# Altium schematic sheet Schematic.SchDoc
size A4
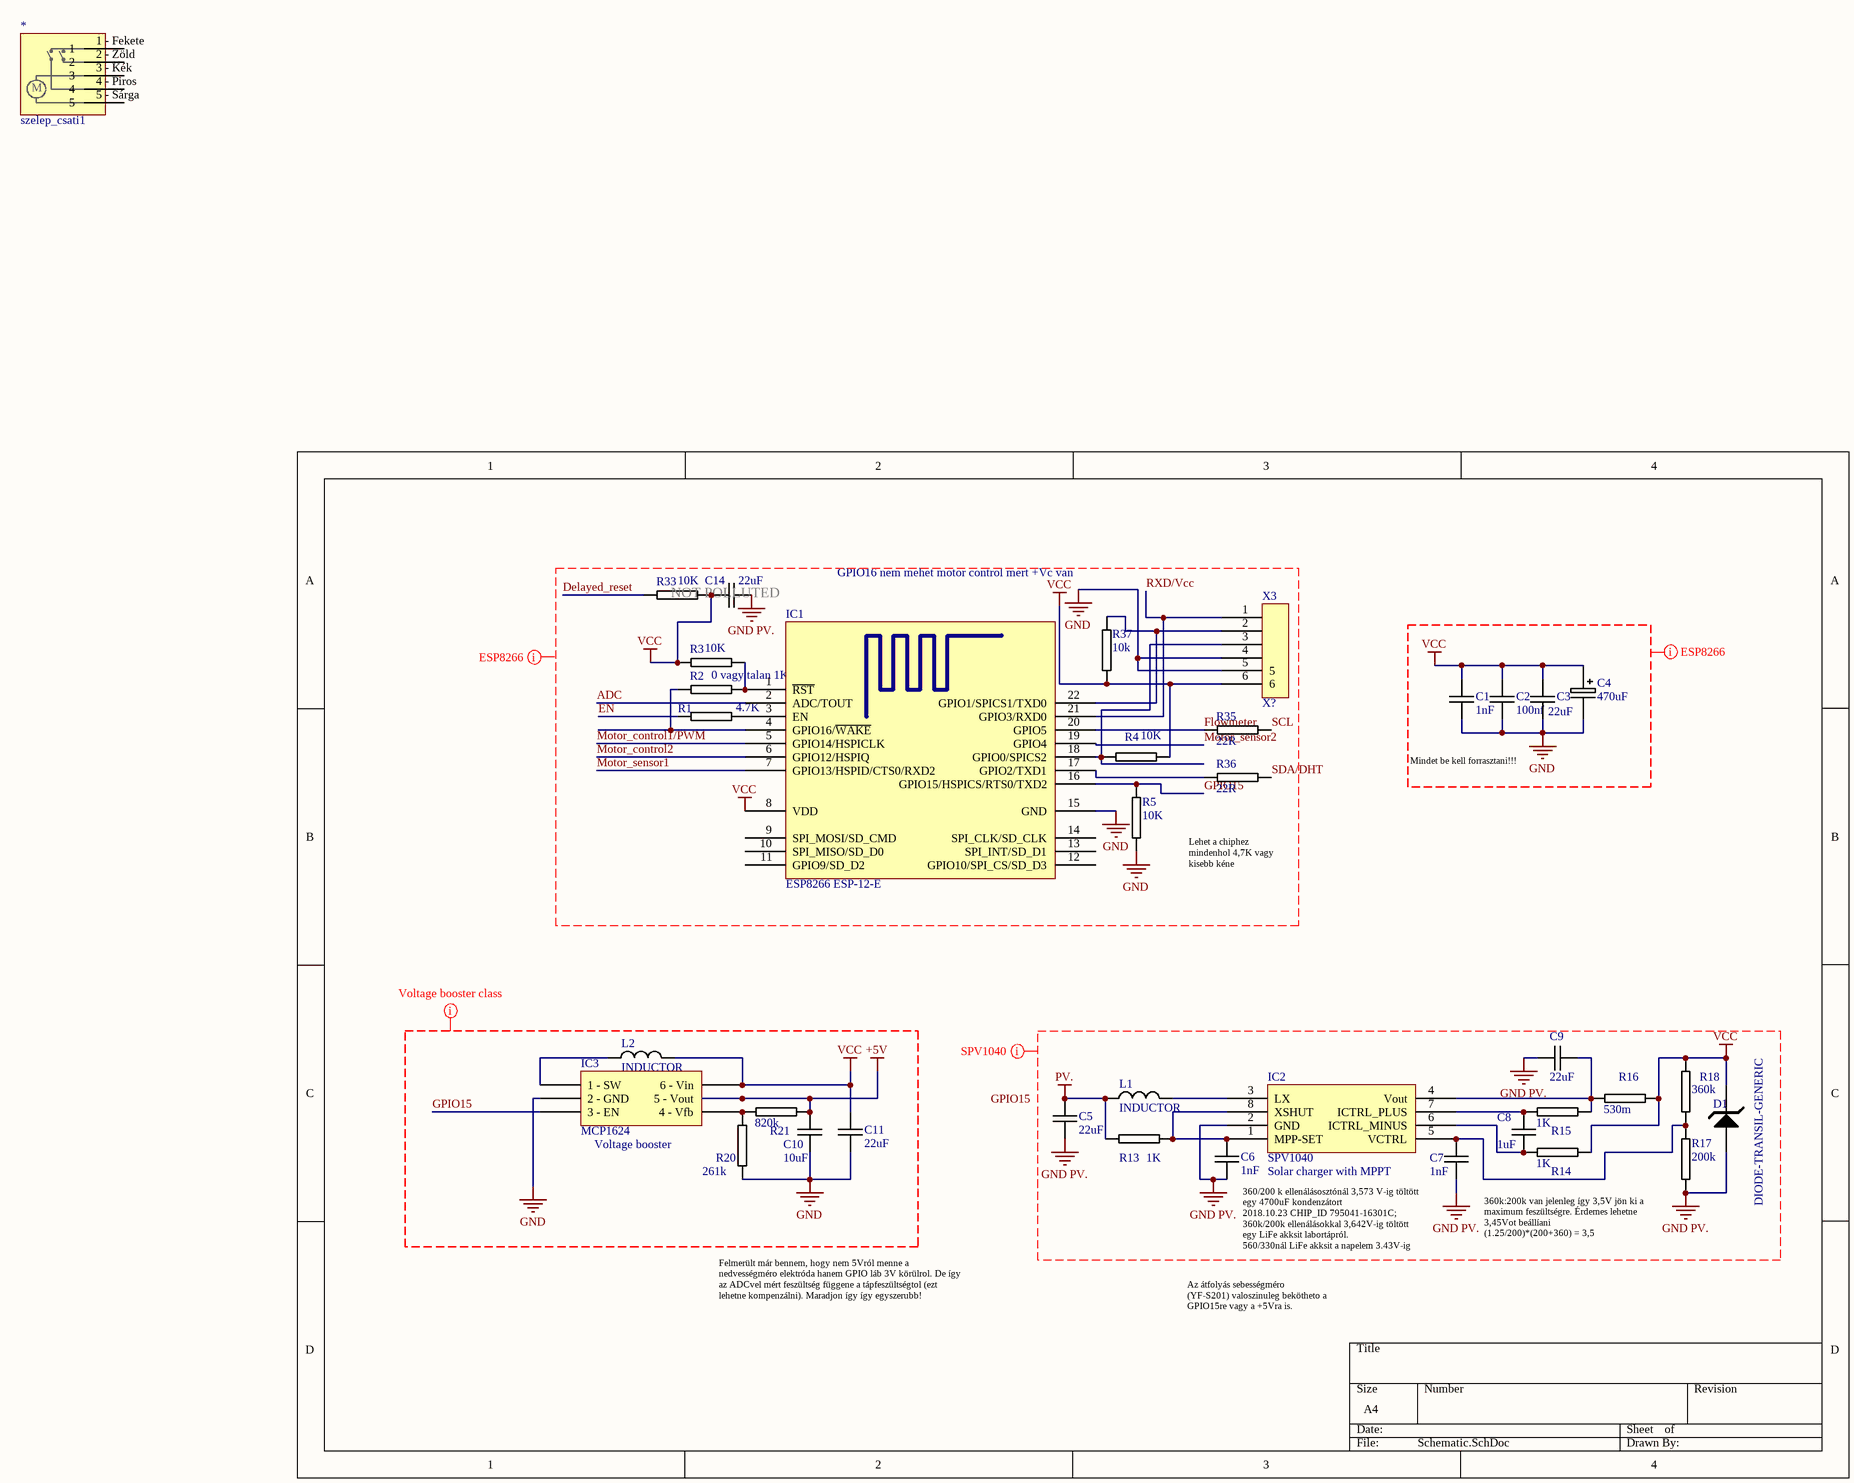
[diagram p0: Schematic.SchDoc]

## Parts
*  szelep_csati1  [Szelep_csati]
C1  1nF  [0805C-TBD]
C2  100nf  [1206C-GENERIC]
C3  22uF  [1206C-GENERIC]
C4  470uF  [PANACAP-D-GENERIC]
C5  22uF  [1206C-GENERIC]
C6  1nF  [0805C-TBD]
C7  1nF  [1206C-GENERIC]
C8  1uF  [0805C-TBD]
C9  22uF  [1206C-GENERIC]
C10  10uF  [1206C-GENERIC]
C11  22uF  [1206C-GENERIC]
C14  22uF  [0805C-GENERIC]
D1  DIODE-TRANSIL-GENERIC  [SOD523]
IC1  ESP8266 ESP-12-E  [ESP8266 ESP-12-E]
IC2  SPV1040  [SPV1040]
IC3  MCP1624  [SOT23-6]
L1  INDUCTOR  [Inductor 6x6mm]
L2  INDUCTOR  [INDM2520X190N]
R1  4.7K  [0805R-10K]
R2  0 vagy talan 1K?  [1206FB-50Z]
R3  10K  [0805R-10K]
R4  10K  [1206C-GENERIC]
R5  10K  [0805R-10K]
R13  1K  [1206FB-50Z]
R14  1K  [0805R-1K]
R15  1K  [0805R-1K]
R16  530m  [1206FB-50Z]
R17  200k  [0805R-680K]
R18  360k  [0805R-680K]
R20  261k  [0805R-820K]
R21  820k  [0805R-560K]
R33  10K  [0805R-10K]
R35  22R  [0805R-22]
R36  22R  [0805R-22]
R37  10k  [0805R-22]
X3  X?  [program port]

## Nets
+5V: C10.1 IC3.5(5_-_Vout) R21.2
GND: C1.2 C2.2 C3.2 C4.- C10.2 C11.2 IC1.15(GND) IC3.2(2_-_GND) R5.1 R20.2 X3.4 X3.5
GND PV.: C5.2 C6.2 C7.2 C9.1 C14.2 D1.A IC2.2(GND) R17.2
PV.: C5.1 L1.1 R13.2
VCC: C1.1 C2.1 C3.1 C4.+ C11.1 C14.1 D1.K IC1.8(VDD) IC3.6(6_-_Vin) L2.2 R3.1 R4.2 R14.1 R16.1 R18.1 R33.2 R37.2 X3.6
ADC: IC1.2(ADC/TOUT)
Delayed_reset: R33.1
EN: R1.1
Flowmeter: IC1.20(GPIO5) R35.2
GPIO15: IC1.16(GPIO15/HSPICS/RTS0/TXD2) IC3.3(3_-_EN) R5.2
Motor_control1/PWM: IC1.5(GPIO14/HSPICLK)
Motor_control2: IC1.6(GPIO12/HSPIQ)
Motor_sensor1: IC1.7(GPIO13/HSPID/CTS0/RXD2)
Motor_sensor2: IC1.19(GPIO4)
RXD/Vcc: IC1.21(GPIO3/RXD0) X3.1
SCL: R35.1
SDA/DHT: R36.1
NetC6_1: C6.1 IC2.1(MPP-SET) IC2.8(XSHUT) R13.1
NetC7_1: C7.1 IC2.5(VCTRL) R17.1 R18.2
NetC8_1: C8.1 IC2.7(ICTRL_PLUS) R15.2
NetC8_2: C8.2 IC2.6(ICTRL_MINUS) R14.2
NetC9_2: C9.2 IC2.4(Vout) R15.1 R16.2
NetIC1_1: IC1.1(~{RST}) R2.1 R3.2
NetIC1_3: IC1.3(EN) R1.2
NetIC1_4: IC1.4(GPIO16/~{WAKE}) R2.2
NetIC1_17: IC1.17(GPIO2/TXD1) R36.2
NetIC1_18: IC1.18(GPIO0/SPICS2) R4.1 X3.3
NetIC1_22: IC1.22(GPIO1/SPICS1/TXD0) R37.1 X3.2
NetIC2_3: IC2.3(LX) L1.2
NetIC3_1: IC3.1(1_-_SW) L2.1
NetIC3_4: IC3.4(4_-_Vfb) R20.1 R21.1

Not connected (* = marked no-connect by the designer): * 1 - Fekete(1) 2 - Zöld(2) 3 - Kék(3) 4 - Piros(4) 5 - Sárga(5); IC1 9(SPI_MOSI/SD_CMD) 10(SPI_MISO/SD_D0) 11(GPIO9/SD_D2) 12(GPIO10/SPI_CS/SD_D3) 13(SPI_INT/SD_D1) 14(SPI_CLK/SD_CLK)

## Layout directives
net class SPV1040: GND PV., PV., VCC
net class ESP8266: ADC, Delayed_reset, EN, Flowmeter, GND, GND PV., GPIO15, Motor_control1/PWM, Motor_control2, Motor_sensor1, Motor_sensor2, RXD/Vcc, SCL, SDA/DHT, VCC
net class Voltage Booster: +5V, GND, GPIO15, VCC

## Notes on the sheet
- NOT POLLUTED
- (near R37) GPIO16 nem mehet motor control mert +Vc van
- Mindet be kell forrasztani!!!
- Lehet a chiphez mindenhol 4,7K vagy kisebb kéne
- (near IC3) Voltage booster
- Solar charger with MPPT
- 360k:200k van jelenleg így 3,5V jön ki a maximum feszültségre. Érdemes lehetne 3,45Vot beállíani
  (1.25/200)*(200+360) = 3,5
- Felmerült már bennem, hogy nem 5Vról menne a nedvességméro elektróda hanem GPIO láb 3V körülrol. De így az ADCvel mért feszültség függene a tápfeszültségtol (ezt lehetne kompenzálni). Maradjon így így egyszerubb!
- 360/200 k ellenálásosztónál 3,573 V-ig töltött egy 4700uF kondenzátort
  2018.10.23 CHIP_ID 795041-16301C; 360k/200k ellenálásokkal 3,642V-ig töltött egy LiFe akksit labortápról.
  560/330nál LiFe akksit a napelem 3.43V-ig töltött
- Az átfolyás sebességméro (YF-S201) valoszinuleg bekötheto a GPIO15re vagy a +5Vra is.
- Labels drawn without touching a wire or pin: GPIO15
- (in symbol szelep_csati1) M

## Library data of the parts
C1 C6 = 0805C-100nF-25V-X7R-MUR: CAPACITOR 0805 CERAMIC; Supplier 1: Digi-Key; Supplier Part Number 1: 490-1673-1-ND
C2 C3 C5 C7 C9-C11 = 1206C-10U-35V-X7R: GENERIC CAPACITOR NON POLARISED 1206; Manufacturer Part Number: GMK316F106ZL-T; Manufacturer: Taiyo Yuden; Reel: C90; Supplier 1: Digi-Key; Supplier Part Number 1: 587-1352-2-ND
C4 = C+47U-6V3: GENERIC CAPACITOR POLARISED; Supplier 1: Digi-Key; Supplier Part Number 1: PCE4375TR-ND
C8 = 0805C-TBD: CAPACITOR 0805 CERAMIC VALUE TO BE DETERMINED
C14 = C0805-GENERIC: GENERIC CAPACITOR NON POLARISED0603
D1 = DIODE-TRANSIL-GENERIC: GENERIC TRANSIL
IC3 = MCP1623
R1 R3-R5 R33 = 0805R-10K: RESISTOR 0805 1/4 WATT THIN FILM; Reel: *
R2 R13 R16 = 0805R-1R: RESISTOR 0805 1/3 WATT; REEL: R84; Supplier 1: Digi-Key; Supplier Part Number 1: 541-1.0TADKR-ND
R14 R15 = 0805R-1K: RESISTOR 0805 1/4 WATT THIN FILM; Reel: *
R17 R18 = 0805R-680K: RESISTOR 0805 1/4 WATT THIN FILM; Reel: *
R20 = 0805R-820K: RESISTOR 0805 1/4 WATT THIN FILM; Reel: *
R21 = 0805R-560K: RESISTOR 0805 1/4 WATT THIN FILM; Reel: *
R35-R37 = 0805R-22: RESISTOR 0805 1/4 WATT THIN FILM; Reel: *
X3 = program port